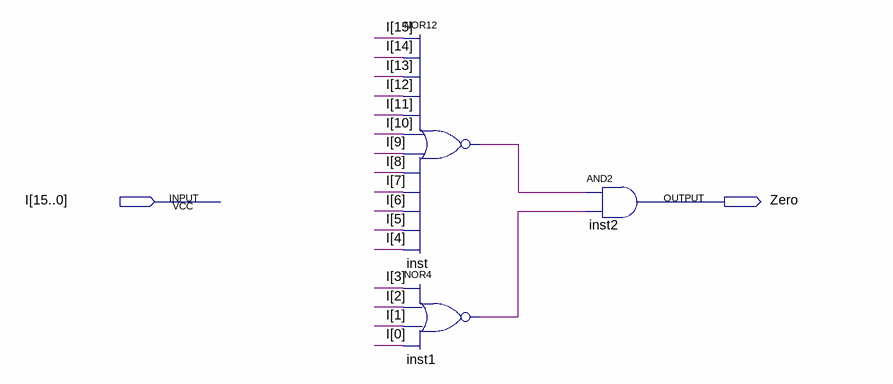
[diagram p0: schematic sheet]
// Quartus schematic check_zero.bdf as structural Verilog: 3 symbols, 2 pins
module check_zero (
  input  [15:0] I,
  output Zero
);

  wire inst1_out, inst_out;

  nor inst (inst_out, I[15], I[14], I[13], I[12], I[11], I[10], I[9], I[8], I[7], I[6], I[5], I[4]);
  nor inst1 (inst1_out, I[3], I[2], I[1], I[0]);
  and inst2 (Zero, inst_out, inst1_out);
endmodule
